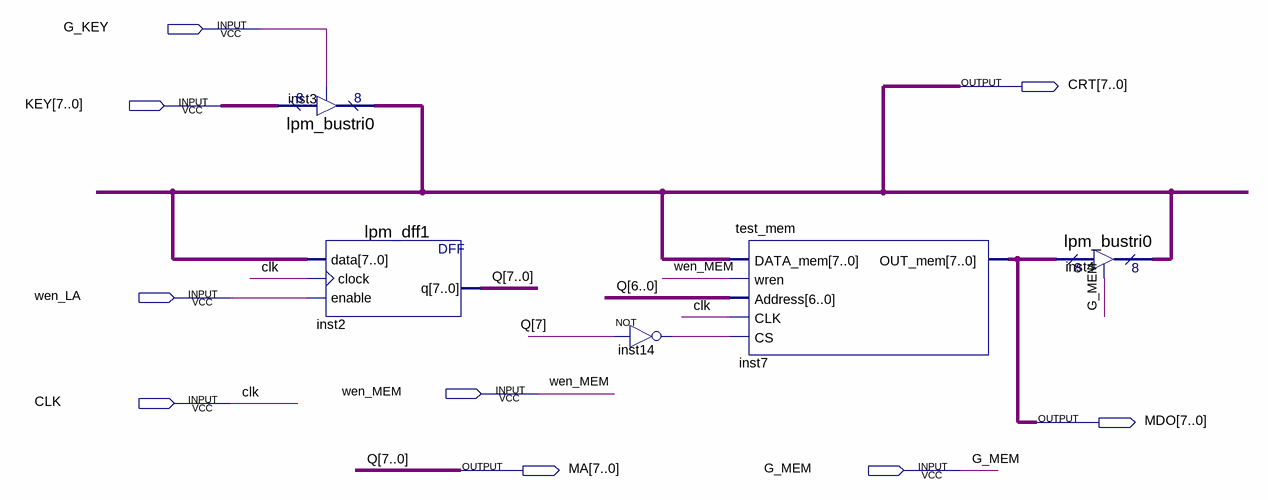
[diagram p0: schematic sheet]
// Quartus schematic test_bus_mem.bdf as structural Verilog: 5 symbols, 9 pins
module test_bus_mem (
  input  G_KEY,
  input  [7:0] KEY,
  input  wen_LA,
  input  wen_MEM,
  input  CLK,
  input  G_MEM,
  output [7:0] CRT,
  output [7:0] MDO,
  output [7:0] MA
);

  wire inst14_out;

  lpm_bustri0 inst3 (.enabledt(G_KEY), .data(KEY), .tridata(CRT));
  lpm_dff1 inst2 (.data(CRT), .clock(CLK), .enable(wen_LA), .q(MA));
  not inst14 (inst14_out, MA[7]);
  test_mem inst7 (.DATA_mem(CRT), .wren(wen_MEM), .Address(MA[6:0]), .CLK(CLK), .CS(inst14_out), .OUT_mem(MDO));
  lpm_bustri0 inst4 (.enabledt(G_MEM), .data(MDO), .tridata(CRT));

  // Other names for the same wires on the sheet: Q[7:0] = MA
endmodule
